# EAGLE design main (EAGLE 7.5.0)
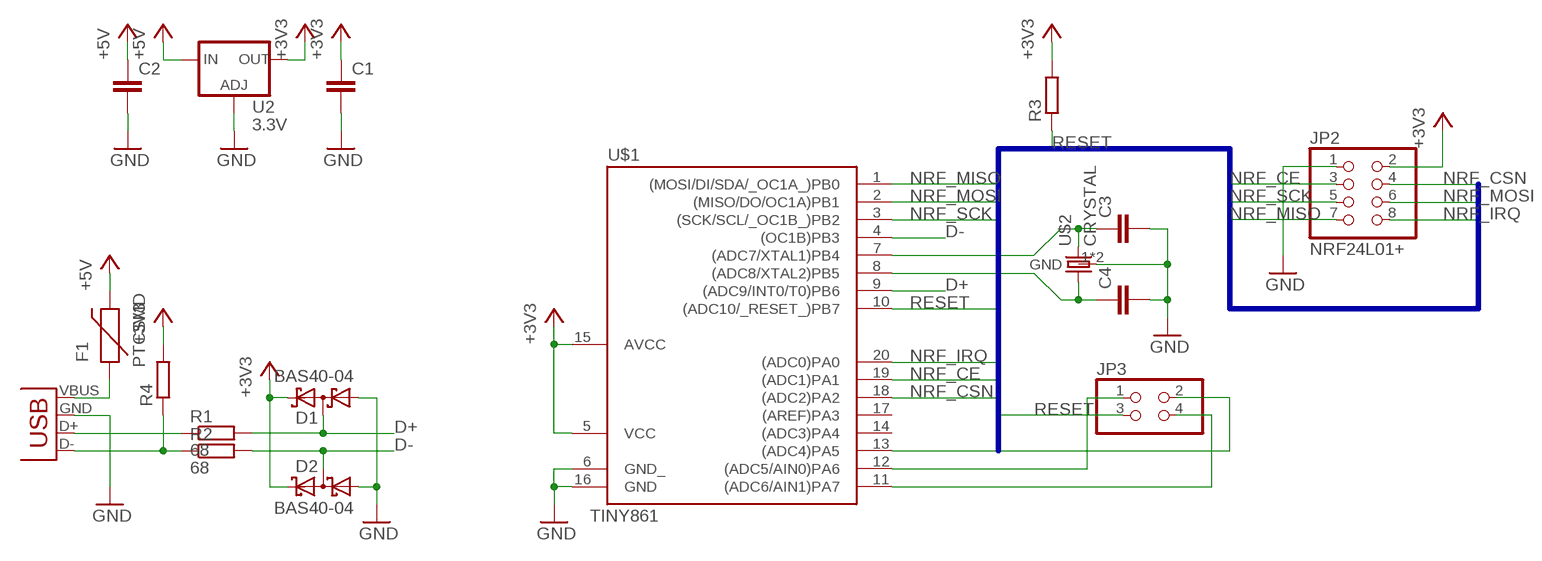
[diagram p0: schematic, sheet 1]

## Parts
C1  C-EUC1206  [C1206]
C2  C-EUC1206  [C1206]
C3  C-EUC0805  [C0805]
C4  C-EUC0805  [C0805]
D1  BAS40-04  [SOT23]
D2  BAS40-04  [SOT23]
F1  PTCSMD  [PTC-1206]
JP1  USB-A-H  [USB-A-H]
JP2  NRF24L01+  PINHD-2X4  [2X04]
JP3  PINHD-2X2  [2X02]
R1  68  R-EU_R1206  [R1206]
R2  68  R-EU_R1206  [R1206]
R3  R-EU_R1206  [R1206]
R4  R-EU_R1206  [R1206]
U2  3.3V  V_REG_317SMD  [SOT223]
U$1  TINY861  TINY26S  [SO20L$]
U$2  CRYSTAL  [5X7]

## Nets
+3V3: C1.1 D1.2(C2) D2.2(C2) JP2.2 R3.2 R4.2 U2.2(OUT) U$1.5(VCC) U$1.15(AVCC)
+5V: C2.1 F1.2 U2.3(IN)
D+: D1.3(C1A2) R1.2 U$1.9((ADC9/INT0/T0)PB6)
D-: D2.3(C1A2) R2.2 U$1.4((OC1B)PB3)
GND: C1.2 C2.2 C3.2 C4.2 D1.1(A1) D2.1(A1) JP1.GND(VBUS) JP2.1 U2.1(ADJ) U$1.6(GND_) U$1.16(GND) U$2.1(GND) U$2.3(GND)
N$1: F1.1 JP1.VBUS(GND)
N$2: C3.1 U$1.7((ADC7/XTAL1)PB4) U$2.4
N$3: JP1.D+(D-) R1.1
N$4: JP1.D-(D+) R2.1 R4.1
N$5: C4.1 U$1.8((ADC8/XTAL2)PB5) U$2.2
N$6: JP3.4 U$1.11((ADC6/AIN1)PA7)
N$7: JP3.1 U$1.12((ADC5/AIN0)PA6)
N$8: JP3.2 U$1.13((ADC4)PA5)
NRF_CE: JP2.3 U$1.19((ADC1)PA1)
NRF_CSN: JP2.4 U$1.18((ADC2)PA2)
NRF_IRQ: JP2.8 U$1.20((ADC0)PA0)
NRF_MISO: JP2.7 U$1.1((MOSI/DI/SDA/_OC1A_)PB0)
NRF_MOSI: JP2.6 U$1.2((MISO/DO/OC1A)PB1)
NRF_SCK: JP2.5 U$1.3((SCK/SCL/_OC1B_)PB2)
RESET: JP3.3 R3.1 U$1.10((ADC10/_RESET_)PB7)
Unconnected: U$1.14((ADC3)PA4) U$1.17((AREF)PA3)

## Buses
NRF_CE,NRF_SCK,NRF_MISO,NRF_CSN,NRF_MOSI,NRF_IRQ,RESET

## Library data of the parts
C1-C4 = rcl:C-EU: CAPACITOR, European symbol
D1 D2 = diode:BAS40-04: Silicon Schottky Diodes General-purpose diode for high-speed switching
F1 = SparkFun-PowerIC:PTC: Resettable Fuse PTC Resettable Fuse. Spark Fun Electronics SKU : COM-08357; PROD_ID: RES-11150
JP1 = SparkFun-Connectors:USB: USB Connectors USB-B-PTH is fully proven SKU : PRT-00139/CONN-08278 USB-miniB is fully proven SKU : PRT-00587 USB-A-PCB is untested. USB-A-H is throughly reviewed, but untested. Spark Fun Electronics SKU : PRT-00437 USB-B-SMT is throughly reviewed, but untested. Needs silkscreen touching up. USB-A-S has not been used/tested USB-MB-H has not been used/tested USB-MICROB has been used. CONN-09505
JP2 = pinhead:PINHD-2X4: PIN HEADER
JP3 = pinhead:PINHD-2X2: PIN HEADER
R1-R4 = rcl:R-EU_: RESISTOR, European symbol
U2 = SparkFun-PowerIC:V_REG_317: Voltage Regulator Standard LM317 adjustable voltage regulator. AOI (Adjust Output Input). Google 'LM317 Calculator' for easy to use app to get the two resistor values needed. 240/720 for 5V output. 240/390 for 3.3V output. Spark Fun Electronics SKU : COM-00527
U$1 = avr-7:TINY26: Atmel Tiny26/261/461/861
U$2 = crystal3:CRYSTAL

## Board
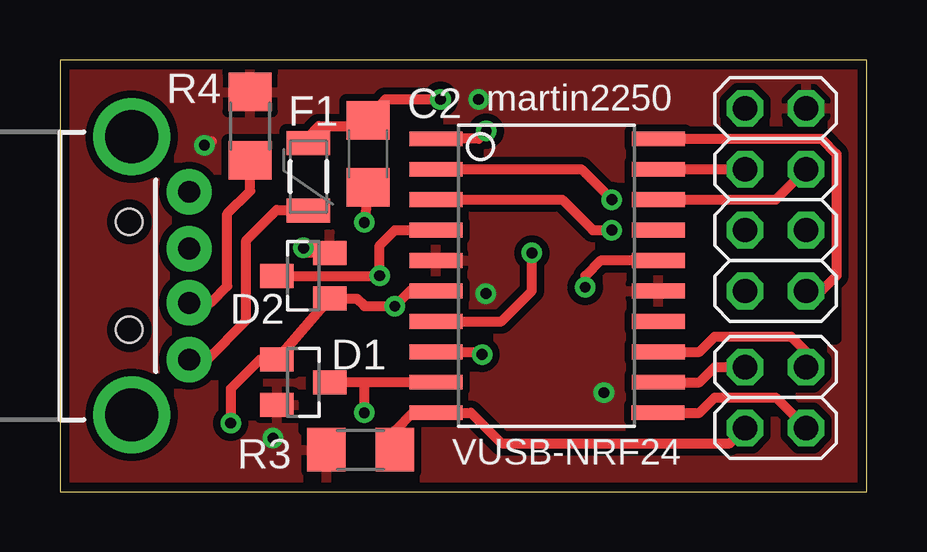
[diagram p1: board, top side]
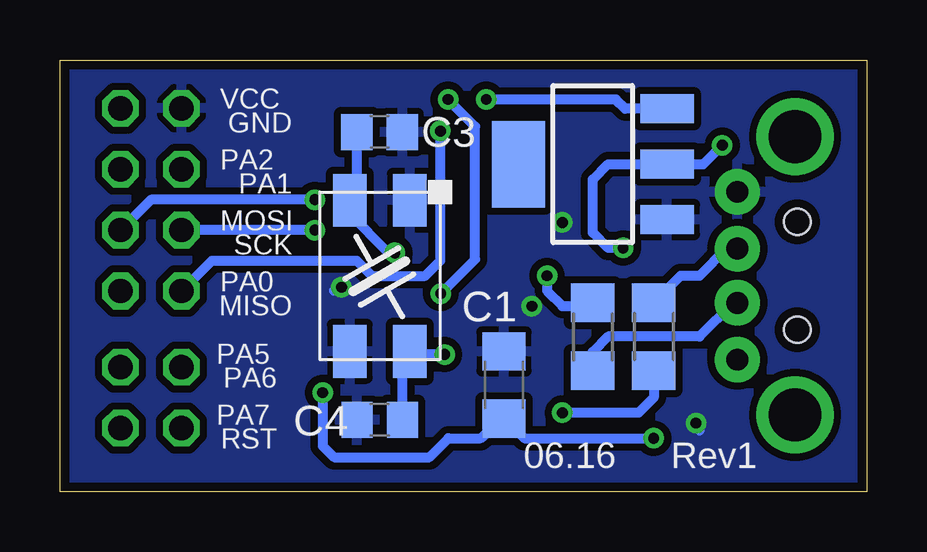
[diagram p2: board, bottom side, seen from below]

Size 33.63 x 18 mm. Coordinates in mm from the lower left corner, seen from the top.
Outline: 0,0 33.63,0 33.63,18 0,18 0,0
Copper layers (1*16): Top 0.035mm / dielectric 1.5mm / Bottom 0.035mm
Design rules "default *": minimum track width 6mil, minimum drill 13mil, track to track 12mil, track to pad 12mil, pad to pad 12mil, via to via 12mil, smd to smd 12mil, copper to edge 15mil, drill to drill 8mil, minimum pad ring 10mil, minimum via ring 8mil, stop-mask expansion 4mil, vias tented up to drill 100mil, thermal gap 10mil
tRestrict: area 12.1,9.5 to 14.6,10.8; area 7.6,3.2 to 8.2,4.4; area 12.1,0.6 to 13.3,2.5; area 10.2,2.5 to 12.1,3.8; area 26,6.3 to 32.4,11.4; area 7.6,9.5 to 10.8,11.4

### Footprints (pad centres in the part's own frame; a part is rotated, then mirrored left to right if it is on the bottom)
C1206 = smd 1.6 x 1.8: 1 -1.4,0; 2 1.4,0
C0805 = smd 1.3 x 1.5: 1 -0.95,0; 2 0.95,0
SOT23 = smd 1 x 1.4: 1 -0.95,-1.1; 2 0.95,-1.1; 3 0,1.1
PTC-1206 = smd 1 x 1.8: 1 -1.4,0; 2 1.4,0
USB-A-H = drill 0.914 pad 1.88: D+ 2.4,1.127; D- 2.4,-1.127; GND 2.4,3.5; VBUS 2.4,-3.5 | drill 2.2: GND2 0,-5.8; GND3 0,5.8 | hole 1.1: -0.1,2.25; -0.1,-2.25
2X04 = drill 1.016 octagon: 1 -3.81,-1.27; 2 -3.81,1.27; 3 -1.27,-1.27; 4 -1.27,1.27; 5 1.27,-1.27; 6 1.27,1.27; 7 3.81,-1.27; 8 3.81,1.27
2X02 = drill 1.016 octagon: 1 -1.27,-1.27; 2 -1.27,1.27; 3 1.27,-1.27; 4 1.27,1.27
R1206 = smd 1.6 x 1.803: 1 -1.422,0; 2 1.422,0
SOT223 = smd 1.219 x 2.235: 1 -2.311,-3.099; 2 0,-3.099; 3 2.311,-3.099 | smd 3.6 x 2.2: 4 0,3.099
SO20L$ = smd 0.61 x 2.21: 1 -5.715,-4.636; 2 -4.445,-4.636; 3 -3.175,-4.636; 4 -1.905,-4.636; 5 -0.635,-4.636; 6 0.635,-4.636; 7 1.905,-4.636; 8 3.175,-4.636; 9 4.445,-4.636; 10 5.715,-4.636; 11 5.715,4.61; 12 4.445,4.636; 13 3.175,4.636; 14 1.905,4.636; 15 0.635,4.636; 16 -0.635,4.636; 17 -1.905,4.636; 18 -3.175,4.636; 19 -4.445,4.636; 20 -5.715,4.636
5X7 = smd 2.2 x 1.4: 1 -3.15,1.25; 2 3.15,1.25; 3 3.15,-1.25; 4 -3.15,-1.25

### Placement (x,y rotation side)
C1  15.12,4.45 90 bottom
C2  12.85,14.08 270 top
C3  20.31,15 0 bottom
C4  20.3,3 180 bottom
D1  10.15,4.55 270 top
D2  10.15,9 90 top
F1  10.36,13.13 90 top
JP1  2.99,9 0 top
JP2  29.83,12.18 270 top
JP3  29.83,3.92 270 top
R1  8.88,6.46 270 bottom
R2  11.42,6.46 90 bottom
R3  12.53,1.75 180 top
R4  7.93,15.24 90 top
U2  11.42,13.65 90 bottom
U$1  20.31,9 270 top
U$2  20.3,9 270 bottom

### Tracks (layer width: path | path; a pad name or v marks a point on that pad's centre or on a via)
+3V3  (via drill 0.45)
  Top 0.406: D2.2 10.36,9.95 v10.15,10.16 | v6.02,14.45 6.18,14.45 6.34,14.61
  Bottom 0.406: v8.88,2.22 14.28,2.22 15.1,3.04 C1.1 16.1,2.22 17.44,2.22 18.23,1.43 22.2,1.43 22.68,1.91 v22.68,4.13 | v17.76,8.26 16.33,9.68 16.33,15.23 v17.45,16.35 | v10.15,10.16 10.79,10.16 11.42,10.79 11.42,13.02 10.79,13.65 U2.2 6.82,13.65 v6.02,14.45
  pour Top: -0.01,17.89 33.64,17.89 33.64,0.11 -0.01,0.11
+5V  (via drill 0.45)
  Top 0.406: v15.87,16.35 13.56,16.35 C2.1 12.61,15.24 10.79,15.24 10.36,14.81 F1.2
  Bottom 0.406: U2.3 10.07,15.96 10.45,16.35 v15.87,16.35
D+  (via drill 0.45)
  Top 0.406: U$1.9 12.69,4.55 | 12.69,4.55 D1.3 | v12.69,3.29 12.69,4.55
  Bottom 0.406: R1.2 8.88,3.92 9.52,3.29 v12.69,3.29
D-  (via drill 0.45)
  Top 0.406: D2.3 v13.33,9 13.33,10.27 13.96,10.9 U$1.4
  Bottom 0.406: v13.33,9 13.33,8.37 12.69,7.73 11.57,7.73 R2.2
GND  (via drill 0.45)
  Top 0.406: C2.2 v12.69,11.22 | U$1.6 14.6,8.37 v13.96,7.73 12.69,7.73 12.37,8.05 D2.1 D1.1 8.34,5.5 7.12,4.29 v7.12,2.86 | U$1.16 22.53,9.63 21.9,9 v21.9,8.52
  Bottom 0.406: v21.9,8.52 22.06,8.52 22.21,8.37 | v7.12,2.86 7.12,2.7 6.96,2.54
  pour Bottom: -0.01,17.89 33.64,17.89 33.64,0.11 -0.01,0.11
N$1
  Top 0.406: JP1.VBUS 6.12,5.5 7.77,7.14 7.77,10.48 9.04,11.75 10.34,11.75 F1.1
N$2  (via drill 0.45)
  Top 0.406: U$1.7 18.4,7.09 19.67,8.37 v19.67,9.95
  Bottom 0.406: C3.1 21.26,12.44 U$2.4 21.57,12.13 21.57,11.59 19.93,9.95 v19.67,9.95
N$3
  Bottom 0.406: JP1.D+ 5.85,10.13 6.98,9 7.76,9 R1.1
N$4
  Top 0.406: R4.1 7.93,12.54 6.98,11.59 6.98,8.57 6.28,7.87 JP1.D-
  Bottom 0.406: JP1.D- 5.56,7.87 6.98,6.46 10.79,6.46 11.42,5.83 R2.1
N$5  (via drill 0.45)
  Top 0.406: U$1.8 17.65,5.83 v17.6,5.71
  Bottom 0.406: C4.1 19.35,5.55 U$2.2 18.91,5.71 v17.6,5.71
N$6
  Top 0.406: U$1.11 26.66,3.29 27.29,3.92 29.83,3.92 JP3.4
N$7
  Top 0.406: U$1.12 26.66,4.55 27.29,5.19 JP3.1
N$8
  Top 0.406: U$1.13 26.66,5.83 27.29,6.46 30.47,6.46 31.1,5.83 JP3.2
NRF_CE
  Top 0.406: U$1.19 JP2.3
NRF_CSN
  Top 0.406: U$1.18 29.83,12.18 JP2.4
NRF_IRQ
  Top 0.406: U$1.20 31.74,14.71 32.38,14.08 32.38,9 31.74,8.37 JP2.8
NRF_MISO  (via drill 0.45)
  Top 0.406: v17.77,15.03 17.45,14.71 U$1.1
  Bottom 0.406: v17.77,15.03 17.77,9.63 18.4,9 20.63,9 21.26,9.63 27.29,9.63 JP2.7
NRF_MOSI  (via drill 0.45)
  Top 0.406: U$1.2 21.74,13.45 v23.01,12.18
  Bottom 0.406: v23.01,12.18 29.83,12.18 JP2.6
NRF_SCK  (via drill 0.45)
  Top 0.406: U$1.3 20.94,12.18 22.21,10.9 v23.01,10.9
  Bottom 0.406: v23.01,10.9 JP2.5
RESET
  Top 0.406: JP3.3 27.93,2.02 18.4,2.02 17.13,3.29 U$1.10 14.71,3.29 13.96,2.54 R3.1

### Text on the board
tPlace: martin2250 | VUSB-NRF24
bPlace: Rev1 | 06.16
tNames: F1
bNames: VCC / PA2 / MOSI / PA0 | GND / PA1 / SCK / MISO | PA5 / PA7 | PA6 / RST